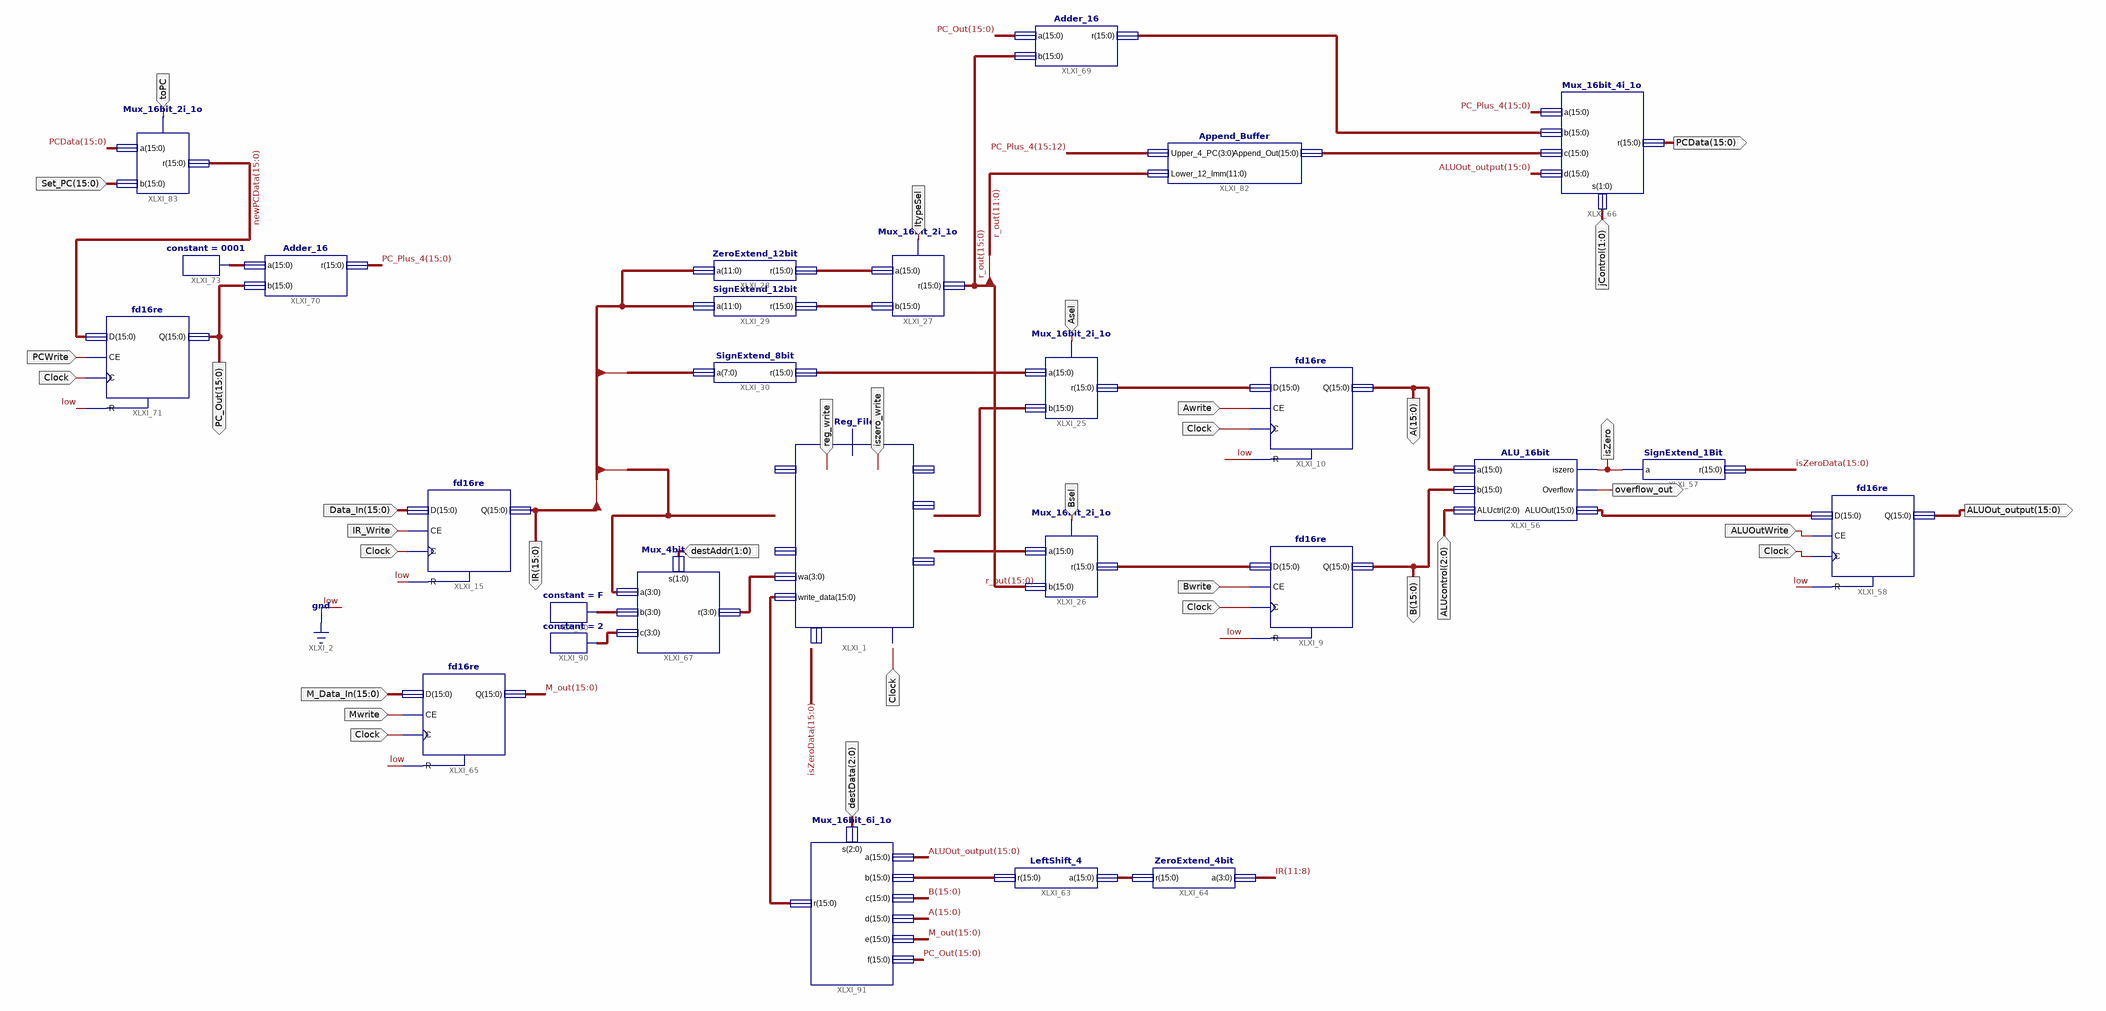
[diagram p0: schematic sheet 1]
// Xilinx ISE schematic Processor_Integration_5.sch (spartan3e) as structural Verilog: 27 symbols, 28 ports
module Processor_Integration_5 (
  input  reg_write,
  input  iszero_write,
  input  [15:0] Data_In,
  input  IR_Write,
  input  Clock,
  input  ItypeSel,
  input  Bsel,
  input  Asel,
  input  Bwrite,
  input  Awrite,
  input  [2:0] ALUcontrol,
  input  ALUOutWrite,
  input  [15:0] M_Data_In,
  input  Mwrite,
  input  [1:0] jControl,
  input  PCWrite,
  input  [15:0] Set_PC,
  input  toPC,
  input  [1:0] destAddr,
  input  [2:0] destData,
  output [15:0] B,
  output [15:0] A,
  output isZero,
  output overflow_out,
  output [15:0] IR,
  output [15:0] ALUOut_output,
  output [15:0] PCData,
  output [15:0] PC_Out
);

  wire [3:0] write_address, XLXN_147, XLXN_169;
  wire [15:0] ALU_output, append, isZeroData, M_out, newPCData, PC_Plus_4, r_out, write_Data, XLXN_56,
       XLXN_57, XLXN_98, XLXN_101, XLXN_130, XLXN_131, XLXN_152, XLXN_156, XLXN_177, XLXN_188, XLXN_215;

  Reg_File XLXI_1 (
    .write_data(write_Data), .reg_write(reg_write), .iszero_write(iszero_write), .acc_data(XLXN_215),
    .ra(IR[11:8]), .read_data(XLXN_98), .wa(write_address), .iszero_data(isZeroData), .clock(Clock));  // open: in_data_write, out_data, in_data
  SignExtend_12bit XLXI_29 (.a(IR[11:0]), .r(XLXN_57));
  ZeroExtend_12bit XLXI_28 (.a(IR[11:0]), .r(XLXN_56));
  SignExtend_8bit XLXI_30 (.a(IR[7:0]), .r(XLXN_101));
  Mux_16bit_2i_1o XLXI_27 (.b(XLXN_57), .r(r_out), .s(ItypeSel), .a(XLXN_56));
  Mux_16bit_2i_1o XLXI_26 (.b(r_out), .r(XLXN_131), .s(Bsel), .a(XLXN_98));
  Mux_16bit_2i_1o XLXI_25 (.b(XLXN_215), .r(XLXN_130), .s(Asel), .a(XLXN_101));
  fd16re XLXI_9 (.C(Clock), .CE(Bwrite), .D(XLXN_131), .R(1'b0), .Q(B));
  fd16re XLXI_10 (.C(Clock), .CE(Awrite), .D(XLXN_130), .R(1'b0), .Q(A));
  ALU_16bit XLXI_56 (.a(A), .b(B), .ALUctrl(ALUcontrol), .iszero(isZero), .Overflow(overflow_out), .ALUOut(ALU_output));
  SignExtend_1Bit XLXI_57 (.a(isZero), .r(isZeroData));
  fd16re XLXI_58 (.C(Clock), .CE(ALUOutWrite), .D(ALU_output), .R(1'b0), .Q(ALUOut_output));
  fd16re XLXI_15 (.C(Clock), .CE(IR_Write), .D(Data_In), .R(1'b0), .Q(IR));
  LeftShift_4 XLXI_63 (.a(XLXN_156), .r(XLXN_152));
  ZeroExtend_4bit XLXI_64 (.a(IR[11:8]), .r(XLXN_156));
  fd16re XLXI_65 (.C(Clock), .CE(Mwrite), .D(M_Data_In), .R(1'b0), .Q(M_out));
  Mux_16bit_4i_1o XLXI_66 (.a(PC_Plus_4), .b(XLXN_177), .c(append), .d(ALUOut_output), .r(PCData), .s(jControl));
  Adder_16 XLXI_69 (.a(PC_Out), .b(r_out), .r(XLXN_177));
  Adder_16 XLXI_70 (.a(XLXN_188), .b(PC_Out), .r(PC_Plus_4));
  fd16re XLXI_71 (.C(Clock), .CE(PCWrite), .D(newPCData), .R(1'b0), .Q(PC_Out));
  constant #(.CValue("0001")) XLXI_73 (.O(XLXN_188));
  Append_Buffer XLXI_82 (.Upper_4_PC(PC_Plus_4[15:12]), .Lower_12_Imm(r_out[11:0]), .Append_Out(append));
  Mux_16bit_2i_1o XLXI_83 (.b(Set_PC), .r(newPCData), .s(toPC), .a(PCData));
  Mux_4bit_3i_1o XLXI_67 (.s(destAddr), .r(write_address), .a(IR[11:8]), .b(XLXN_147), .c(XLXN_169));
  constant #(.CValue("F")) XLXI_60 (.O(XLXN_147));
  constant #(.CValue("2")) XLXI_90 (.O(XLXN_169));
  Mux_16bit_6i_1o XLXI_91 (
    .s(destData), .r(write_Data), .a(ALUOut_output), .b(XLXN_152), .c(B), .d(A), .e(M_out), .f(PC_Out));
endmodule
